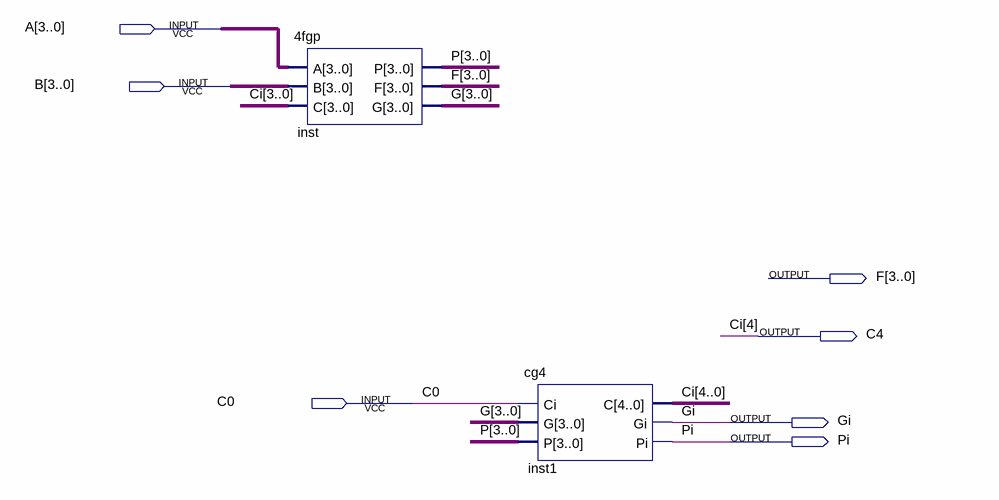
[diagram p0: schematic sheet]
// Quartus schematic add4.bdf as structural Verilog: 2 symbols, 7 pins
module add4 (
  input  [3:0] A,
  input  [3:0] B,
  input  C0,
  output [3:0] F,
  output C4,
  output Gi,
  output Pi
);

  wire [3:0] Ci, G, P;

  \4fgp  inst (.A(A), .B(B), .C(Ci), .P(P), .F(F), .G(G));
  cg4 inst1 (.Ci(C0), .G(G), .P(P), .C({C4, Ci}), .Gi(Gi), .Pi(Pi));

  // Other names for the same wires on the sheet: Ci[4] = C4
endmodule
